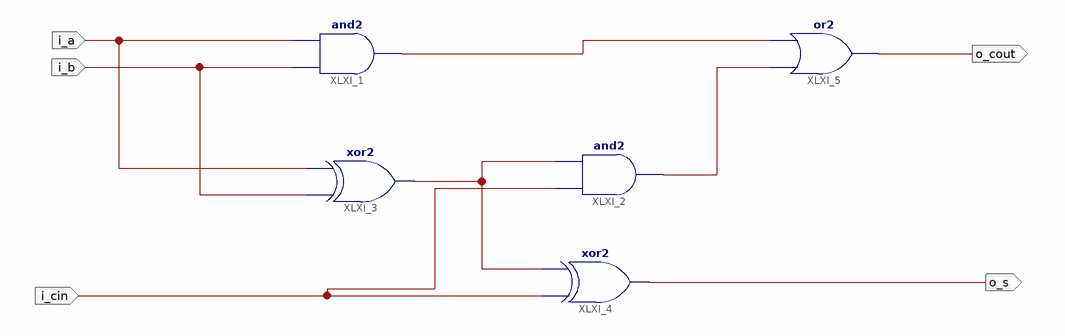
[diagram p0: schematic sheet 1]
// Xilinx ISE schematic Laby5.sch (spartan3e) as structural Verilog: 5 symbols, 5 ports
module Laby5 (
  input  i_a,
  input  i_b,
  input  i_cin,
  output o_cout,
  output o_s
);

  wire XLXN_4, XLXN_5, XLXN_7;

  and XLXI_1 (XLXN_7, i_b, i_a);
  and XLXI_2 (XLXN_4, i_cin, XLXN_5);
  xor XLXI_3 (XLXN_5, i_b, i_a);
  xor XLXI_4 (o_s, i_cin, XLXN_5);
  or XLXI_5 (o_cout, XLXN_4, XLXN_7);
endmodule
